# EasyEDA Pro project WIF电流表带PCB+原理图.epro

# Schematic 电流表0603板优化版
Create Date: 2024-01-17; Page Name: 电流表0603板优化版; Project Name: WIF板电流表pro分享板; Schematic Name: 电流表0603板优化版; Update Date: 2024-01-17; Company: 嘉立创EDA; Page Size: A4; Version: V1.0
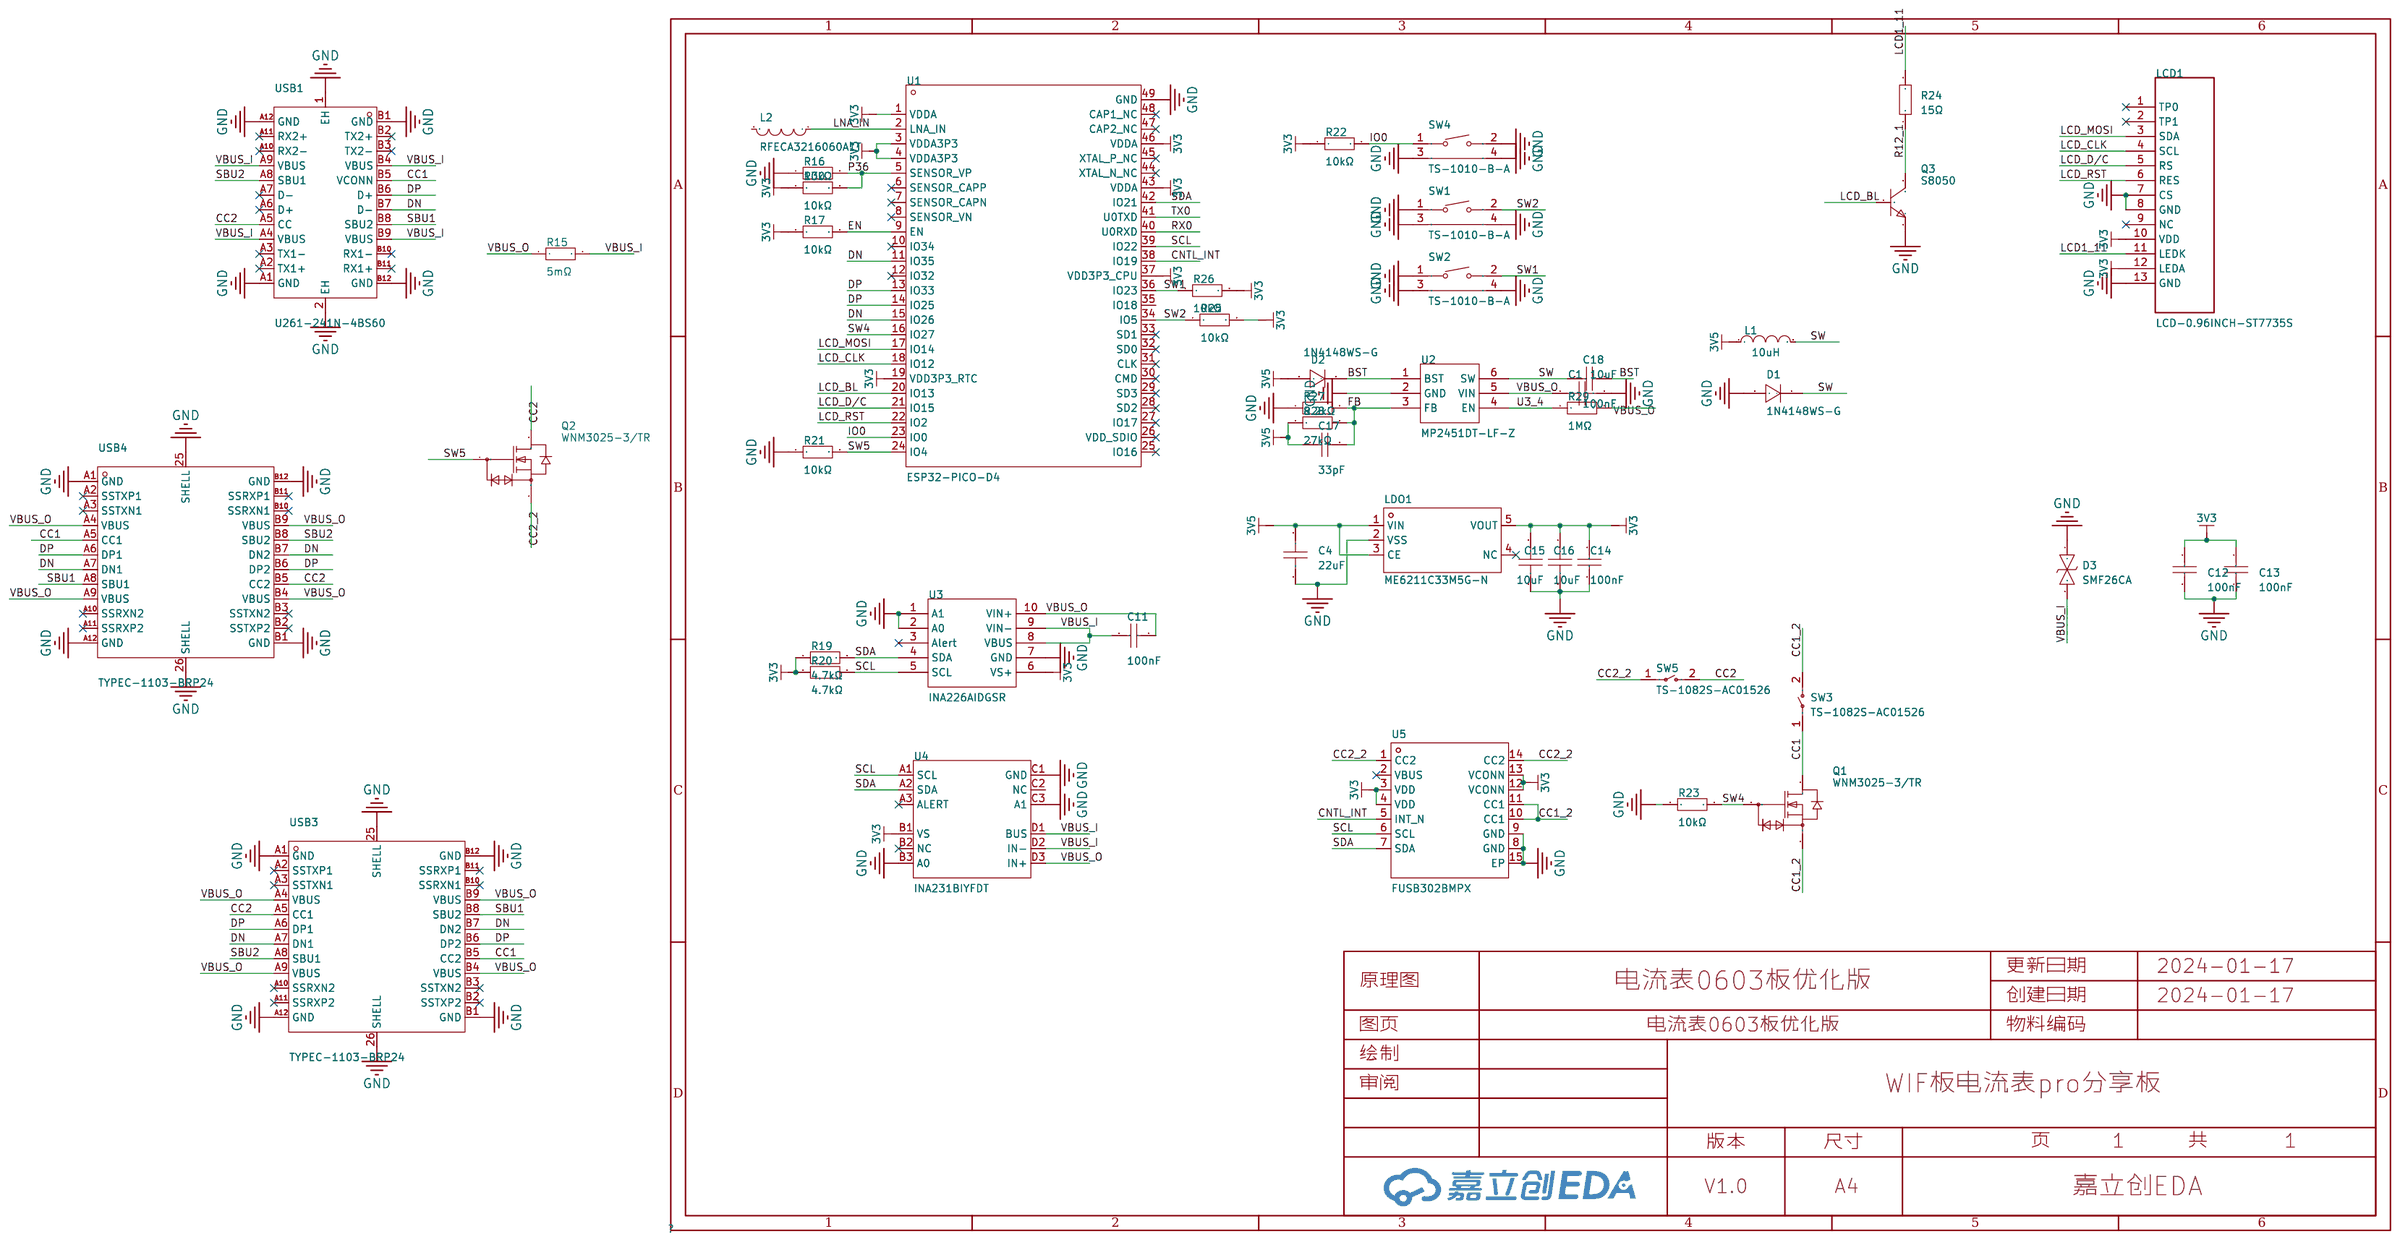
[diagram p0: schematic sheet]

## Parts
C1  10uF  [C0603]
C4  22uF  [C0603]
C11  100nF  [C0603]
C12  100nF  [C0603]
C13  100nF  [C0603]
C14  100nF  [C0603]
C15  10uF  [C0603]
C16  10uF  [C0603]
C17  33pF  [C0603]
C18  100nF  [C0603]
D1  1N4148WS-G  [SOD-323_L1.7-W1.3-LS2.7-RD]
D2  1N4148WS-G  [SOD-323_L1.7-W1.3-LS2.7-RD]
D3  SMF26CA  [SOD-123_L2.8-W1.8-LS3.7-BI]
L1  10uH  [IND-SMD_L4.4-W4.0_PHC0420]
L2  RFECA3216060A1T  [ANT-SMD_L3.1-W1.6]
LCD1  LCD-0.96INCH-ST7735S  [LCD-0.96INCH-IPS-TFT-16080-ST7735S]
LDO1  ME6211C33M5G-N  [SOT-23-5_L3.0-W1.7-P0.95-LS2.8-BL]
Q1  WNM3025-3/TR  [X1-DFN1006-3_L1.0-W0.6-P0.35-BR]
Q2  WNM3025-3/TR  [X1-DFN1006-3_L1.0-W0.6-P0.35-BR]
Q3  S8050  [SOT-23-3_L2.9-W1.3-P1.90-LS2.4-BR]
R15  5mΩ  [R2512]
R16  10kΩ  [R0603]
R17  10kΩ  [R0603]
R19  4.7kΩ  [R0603]
R20  4.7kΩ  [R0603]
R21  10kΩ  [R0603]
R22  10kΩ  [R0603]
R23  10kΩ  [R0603]
R24  15Ω  [R0603]
R25  10kΩ  [R0603]
R26  10kΩ  [R0603]
R27  8.2kΩ  [R0603]
R28  27kΩ  [R0603]
R29  1MΩ  [R0603]
R30  10kΩ  [R0402]
SW1  TS-1010-B-A  [KEY-SMD_TX-1010-X-X]
SW2  TS-1010-B-A  [KEY-SMD_TX-1010-X-X]
SW3  TS-1082S-AC01526  [SW-SMD_L3.9-W3.6-LS4.8-EH]
SW4  TS-1010-B-A  [KEY-SMD_TX-1010-X-X]
SW5  TS-1082S-AC01526  [SW-SMD_L3.9-W3.6-LS4.8-EH]
U1  ESP32-PICO-D4  [LGA-48_L7.0-W7.0-P0.50-BL-EP5.4]
U2  MP2451DT-LF-Z  [SOT-23-6_L2.9-W1.6-P0.95-LS2.8-BR]
U3  INA226AIDGSR  [MSOP-10_L3.0-W3.0-P0.50-LS5.0-BL]
U4  INA231BIYFDT  [DSBGA-12_L1.7-W1.4-R3-C4-P0.40-BL]
U5  FUSB302BMPX  [MLP-14_L2.5-W2.5-P0.50-BL-EP]
USB1  U261-241N-4BS60  [USB-TYPE-C-SMD_U261-241N-4BS60]
USB3  TYPEC-1103-BRP24  [USB-C-SMD_TYPEC-1103-BRP24]
USB4  TYPEC-1103-BRP24  [USB-C-SMD_TYPEC-1103-BRP24]

## Library data of the parts
C1 = CL10A106MA8NRNC: 容值:10uF;精度:±20%;额定电压:25V;材质(温度系数):X5R;; LCSC Part Name: 10uF ±20% 25V; Supplier Part: C96446; Manufacturer: SAMSUNG(三星); Supplier Footprint: 0603; JLCPCB Part Class: 基础库; Datasheet: https://atta.szlcsc.com/upload/public/pdf/source/20160218/1457707763339.pdf; Supplier: LCSC; Tolerance: ±20%; Voltage Rated: 25V; Temperature Coefficient: X5R
C4 = CL10A226MQ8NRNC: 容值:22uF;精度:±20%;额定电压:6.3V;材质(温度系数):X5R;; LCSC Part Name: 22uF ±20% 6.3V; Supplier Part: C59461; Manufacturer: SAMSUNG(三星); Supplier Footprint: 0603; Datasheet: https://atta.szlcsc.com/upload/public/pdf/source/20160218/1457707763339.pdf; Supplier: LCSC; Tolerance: ±20%; Voltage Rated: 6.3V; Temperature Coefficient: X5R
C11-C14 C18 = 0603B104K500NT: 容值:100nF;精度:±10%;额定电压:50V;材质(温度系数):X7R;; LCSC Part Name: 100nF ±10% 50V; Supplier Part: C30926; Manufacturer: FH(风华); Supplier Footprint: 0603; Datasheet: https://atta.szlcsc.com/upload/public/pdf/source/20200305/C486355_26A10D38EF8C2A5C37091D0039909270.pdf; Supplier: LCSC; Tolerance: ±10%; Voltage Rated: 50V; Temperature Coefficient: X7R
C15 C16 = CL10A106KP8NNNC: 容值:10uF;精度:±10%;额定电压:10V;材质(温度系数):X5R;; LCSC Part Name: 10uF ±10% 10V; Supplier Part: C19702; Manufacturer: SAMSUNG(三星); Supplier Footprint: 0603; Datasheet: https://atta.szlcsc.com/upload/public/pdf/source/20160218/1457707763339.pdf; Supplier: LCSC; Tolerance: ±10%; Voltage Rated: 10V; Temperature Coefficient: X5R
C17 = CL10C330JB8NNNC: 容值:33pF;精度:±5%;额定电压:50V;材质(温度系数):C0G;; LCSC Part Name: 33pF ±5% 50V; Supplier Part: C1663; Manufacturer: SAMSUNG(三星); Supplier Footprint: 0603; Datasheet: https://atta.szlcsc.com/upload/public/pdf/source/20160218/1457707763339.pdf; Supplier: LCSC; Tolerance: ±5%; Voltage Rated: 50V; Temperature Coefficient: C0G
D1 D2 = 1N4148WS-G: 二极管配置:独立式;正向压降(Vf):1.25V@150mA;直流反向耐压(Vr):100V;平均整流电流(Io):150mA;功率:200mW;反向恢复时间(trr):4ns;; LCSC Part Name: 电压:100V 电流:150mA; Supplier Part: C164914; Manufacturer: CJ(江苏长电/长晶); Supplier Footprint: SOD-323; Datasheet: https://atta.szlcsc.com/upload/public/pdf/source/20171228/C164914_15144413284821213917.pdf; Supplier: LCSC; Diode Configuration: 独立式; Forward Voltage (Vf@If): 1.25V@150mA; Reverse Voltage (Vr): 100V; Average Rectified Current (Io): 150mA; Power Dissipation: 200mW; Reverse Leakage Current: 1uA@75V; Reverse Recovery Time (trr): 4ns
D3 = SMF26CA_C435495: 极性:双向;反向截止电压(Vrwm):26V;击穿电压:28.9V;峰值脉冲电流(Ipp)@10/1000μs:4.8A;最大钳位电压:42.1V;; LCSC Part Name: 双向 Vrwm:26V; Supplier Part: C435495; Manufacturer: AnBon(安邦); Supplier Footprint: SOD-123; Datasheet: https://atta.szlcsc.com/upload/public/pdf/source/20191009/C435495_EFB4EDACE97A58C3299DB23ED1145BFC.pdf; Supplier: LCSC; Polarity: 双向; Reverse Stand-Off Voltage (Vrwm): 26V; Breakdown Voltage: 28.9V; Peak Pulse Current (Ipp)@10/1000μs: 4.8A; Maximum Clamping Voltage: 42.1V
L1 = PHC0420-100M-T: 电感值:10uH;精度:±20%;额定电流:1.6A;; LCSC Part Name: 10uH ±20% 1.6A 282mΩ; Supplier Part: C251694; Manufacturer: EMTEK(兆欣); Supplier Footprint: SMD; Datasheet: https://atta.szlcsc.com/upload/public/pdf/source/20180810/C251694_68A827D6135E57B1C0B36A701F1CEEFF.pdf; Supplier: LCSC; Tolerance: ±20%; Rated Current: 1.6A; DC Resistance (DCR): 282mΩ
L2 = RFECA3216060A1T: 2.4 GHz 陶瓷天线; Supplier Part: C127620; Manufacturer: Walsin(华新科); Supplier Footprint: 贴片; Datasheet: https://atta.szlcsc.com/upload/public/pdf/source/20180326/C127620_3C564CCA307EE04222EAFCE04B7FD99A.pdf; Supplier: LCSC
LCD1 = LCD-0.96INCH-ST7735S-1
LDO1 = ME6211C33M5G-N: 输出类型:固定;输出极性:正;最大输入电压:6V;输出电压:3.3V;输出电流:500mA;电源纹波抑制比(PSRR):70dB;; Supplier Part: C82942; Manufacturer: MICRONE(南京微盟); Supplier Footprint: SOT-23-5; Datasheet: https://atta.szlcsc.com/upload/public/pdf/source/20170918/C82942_1505727073070976520.pdf; Supplier: LCSC; Output Type: 固定; Output Polarity: 正; Number of Outputs: 1; Maximum Input Voltage: 6V; Output Voltage: 3.3V; Dropout Voltage: 260mV@(200mA); Output Current: 500mA; Power Supply Rejection Ratio (PSRR): 70dB
Q1 Q2 = WNM3025-3/TR: 类型:N沟道;阈值电压(Vgs(th)@Id):1V@250uA;漏源电压(Vdss):50V;连续漏极电流(Id):210mA;功率(Pd):270mW;导通电阻(RDS(on)@Vgs,Id):1.2Ω@10V,450mA;; LCSC Part Name: N沟道 耐压:50V 电流:210mA; Supplier Part: C240200; Manufacturer: WILLSEMI(韦尔); Supplier Footprint: X1-DFN1006-3; Datasheet: https://atta.szlcsc.com/upload/public/pdf/source/20200325/C240200_AABA9DA76AE1A371FB49AC1D4C9095FF.pdf; Supplier: LCSC; Type: N沟道; Gate Threshold Voltage (Vgs(th)@Id): 1V@250uA; Drain Source Voltage (Vdss): 50V; Continuous Drain Current (Id): 210mA; Power Dissipation (Pd): 270mW; Drain Source On Resistance (RDS(on)@Vgs,Id): 1.2Ω@10V,450mA; Total Gate Charge (Qg@Vgs): 1.6nC@10V; Input Capacitance (Ciss@Vds): 23pF@15V; Reverse Transfer Capacitance (Crss@Vds): 5pF@15V; Operating Temperature: -55℃~+150℃@(Tj)
Q3 = S8050_C916390: 晶体管类型:-;集电极电流(Ic):500mA;集射极击穿电压(Vceo):25V;功率(Pd):300mW;; LCSC Part Name: 电流:500mA 耐压:25V; Supplier Part: C916390; Manufacturer: JSMSEMI(杰盛微); Supplier Footprint: SOT-23; Datasheet: https://atta.szlcsc.com/upload/public/pdf/source/20230807/2EB23ED2C820E6EDA7BD0AA9F6E62B00.pdf; Supplier: LCSC; Collector Current (Ic): 500mA; Collector-Emitter Breakdown Voltage (Vceo): 25V; Power Dissipation (Pd): 300mW; Transition Frequency (fT): 150MHz; Collector Cut-Off Current (Icbo): 100nA; Collector-Emitter Saturation Voltage (VCE(sat)@Ic,Ib): 600mV@500mA,50mA
R15 = LR2512-23R005F4: 阻值:5mΩ;精度:±1%;功率:3W;温度系数:±25ppm/℃;; LCSC Part Name: 5mΩ ±1% 3W; Supplier Part: C154688; Manufacturer: RALEC(旺诠); Supplier Footprint: 2512; Datasheet: https://atta.szlcsc.com/upload/public/pdf/source/20191219/C323806_6AA59EC2012F49CDB3E3BC364EF84C00.pdf; Supplier: LCSC; Tolerance: ±1%; Power(Watts): 3W; Temperature Coefficient: ±25ppm/℃
R16 R17 R21-R23 R25 R26 = 0603WAF1002T5E: 阻值:10kΩ;精度:±1%;功率:100mW;温度系数:±100ppm/℃;电阻类型:厚膜电阻;; LCSC Part Name: 10kΩ ±1% 100mW 厚膜电阻; Supplier Part: C25804; Manufacturer: UNI-ROYAL(厚声); Supplier Footprint: 0603; Datasheet: https://atta.szlcsc.com/upload/public/pdf/source/20200306/C422600_1E6D84923E4A46A82E41ADD87F860B5C.pdf; Supplier: LCSC; Tolerance: ±1%; Power(Watts): 100mW; Overload Voltage (Max): 75V; Temperature Coefficient: ±100ppm/℃; Type: 厚膜电阻; Operating Temperature Range: -55℃~+155℃
R19 R20 = 0603WAF4701T5E: 阻值:4.7kΩ;精度:±1%;功率:100mW;温度系数:±100ppm/℃;电阻类型:厚膜电阻;; LCSC Part Name: 4.7kΩ ±1% 100mW 厚膜电阻; Supplier Part: C23162; Manufacturer: UNI-ROYAL(厚声); Supplier Footprint: 0603; Datasheet: https://atta.szlcsc.com/upload/public/pdf/source/20200306/C422600_1E6D84923E4A46A82E41ADD87F860B5C.pdf; Supplier: LCSC; Tolerance: ±1%; Power(Watts): 100mW; Overload Voltage (Max): 75V; Temperature Coefficient: ±100ppm/℃; Type: 厚膜电阻; Operating Temperature Range: -55℃~+155℃
R24 = 0603WAF150JT5E: 阻值:15Ω;精度:±1%;功率:100mW;温度系数:±100ppm/℃;电阻类型:厚膜电阻;; LCSC Part Name: 15Ω ±1% 100mW 厚膜电阻; Supplier Part: C22810; Manufacturer: UNI-ROYAL(厚声); Supplier Footprint: 0603; Datasheet: https://atta.szlcsc.com/upload/public/pdf/source/20200306/C422600_1E6D84923E4A46A82E41ADD87F860B5C.pdf; Supplier: LCSC; Tolerance: ±1%; Power(Watts): 100mW; Overload Voltage (Max): 75V; Temperature Coefficient: ±100ppm/℃; Type: 厚膜电阻; Operating Temperature Range: -55℃~+155℃
R27 = 0603WAF8201T5E: 阻值:8.2kΩ;精度:±1%;功率:100mW;温度系数:±100ppm/℃;电阻类型:厚膜电阻;; LCSC Part Name: 8.2kΩ ±1% 100mW 厚膜电阻; Supplier Part: C25981; Manufacturer: UNI-ROYAL(厚声); Supplier Footprint: 0603; Datasheet: https://atta.szlcsc.com/upload/public/pdf/source/20200306/C422600_1E6D84923E4A46A82E41ADD87F860B5C.pdf; Supplier: LCSC; Tolerance: ±1%; Power(Watts): 100mW; Overload Voltage (Max): 75V; Temperature Coefficient: ±100ppm/℃; Type: 厚膜电阻; Operating Temperature Range: -55℃~+155℃
R28 = 0603WAF2702T5E: 阻值:27kΩ;精度:±1%;功率:100mW;温度系数:±100ppm/℃;电阻类型:厚膜电阻;; LCSC Part Name: 27kΩ ±1% 100mW 厚膜电阻; Supplier Part: C22967; Manufacturer: UNI-ROYAL(厚声); Supplier Footprint: 0603; Datasheet: https://atta.szlcsc.com/upload/public/pdf/source/20200306/C422600_1E6D84923E4A46A82E41ADD87F860B5C.pdf; Supplier: LCSC; Tolerance: ±1%; Power(Watts): 100mW; Overload Voltage (Max): 75V; Temperature Coefficient: ±100ppm/℃; Type: 厚膜电阻; Operating Temperature Range: -55℃~+155℃
R29 = 0603WAF1004T5E: 阻值:1MΩ;精度:±1%;功率:100mW;温度系数:±100ppm/℃;电阻类型:厚膜电阻;; LCSC Part Name: 1MΩ ±1% 100mW 厚膜电阻; Supplier Part: C22935; Manufacturer: UNI-ROYAL(厚声); Supplier Footprint: 0603; JLCPCB Part Class: 基础库; Datasheet: https://atta.szlcsc.com/upload/public/pdf/source/20200306/C422600_1E6D84923E4A46A82E41ADD87F860B5C.pdf; Supplier: LCSC; Tolerance: ±1%; Power(Watts): 100mW; Overload Voltage (Max): 75V; Temperature Coefficient: ±100ppm/℃; Type: 厚膜电阻; Operating Temperature Range: -55℃~+155℃
R30 = RC0402FR-0710KL: 电阻类型:厚膜电阻;阻值:10kΩ;精度:±1%;功率:62.5mW;; LCSC Part Name: 10kΩ ±1% 62.5mW; Supplier Part: C60490; Manufacturer: YAGEO(国巨); Supplier Footprint: 0402; Datasheet: https://atta.szlcsc.com/upload/public/pdf/source/20170606/1496716515432.pdf; Supplier: LCSC; Type: 厚膜电阻; Tolerance: ±1%; Power(Watts): 62.5mW; Temperature Coefficient: ±100ppm/℃; Overload Voltage (Max): 50V; Operating Temperature Range: -55℃~+155℃
SW1 SW2 SW4 = TS-1010-B-A: 触点电流:50mA;额定电压(DC):12V;绝缘电阻:-;电路结构:单刀单掷;安装方式:卧贴;带灯:无;作用力:160gf;机械寿命:10万次;带支架:否;; LCSC Part Name: 4.7*1.9*3.5mm 卧贴 轻触开关; Supplier Part: C318941; Manufacturer: XKB Connectivity(中国星坤); Supplier Footprint: SMD; Datasheet: https://atta.szlcsc.com/upload/public/pdf/source/20200227/C318941_A5A5DBAB1B24E3EFC34CEC5510EE9B45.pdf; Supplier: LCSC; Contact Current: 50mA; Voltage Rating (DC): 12V; Circuit: 单刀单掷; Mounting Style: 卧贴; Actuator Style: 矩形按钮; Actuator/Cap Color: 黑色; With Lamp: 无; Operating Force: 160gf; Mechanical Life: 10万次; Operating Temperature: -30℃~+85℃; Switch Length: 4.7mm; Switch Width: 1.9mm; Switch Height: 3.5mm; Strike Gundam: 否
SW3 SW5 = TS-1082S-AC01526: 电路结构:单刀单掷;触点电流:50mA;额定电压(DC):12V;安装方式:卧贴;绝缘电阻:100MΩ;作用力:260gf@±50gf;机械寿命:10万次;; LCSC Part Name: 3.9*2.9*1.5mm 卧贴 轻触开关; Supplier Part: C720494; Manufacturer: XUNPU(讯普); Supplier Footprint: SMD; JLCPCB Part Class: 扩展库; Datasheet: https://atta.szlcsc.com/upload/public/pdf/source/20200810/C720494_98DBDAE35F8150C1537AC0512F50420B.pdf; Supplier: LCSC; Circuit: 单刀单掷; Actuator Style: 矩形按钮; Switch Length: 3.9mm; Switch Width: 2.9mm; Switch Height: 1.5mm; Contact Current: 50mA; Voltage Rating (DC): 12V; Mounting Style: 卧贴; Insulation Resistance: 100MΩ; Actuator/Cap Color: 黑色; Operating Force: 260gf@±50gf; Pin Style: SMD接片; Mechanical Life: 10万次; Operating Temperature: -30℃~+80℃
U1 = ESP32-PICO-D4: 频率范围:2.4GHz~2.5GHz;接口:ADC, SDIO, SPI, PWM, UART, I2C, I2S, GPIO;应用领域:蓝牙,WiFi;数据速率:-;灵敏度:-;典型应用频率:-;; LCSC Part Name: 集成2.4GHz WIFI和蓝牙的模组; Supplier Part: C193707; Manufacturer: ESPRESSIF(乐鑫); Supplier Footprint: QFN-48-EP(7x7); JLCPCB Part Class: 扩展库; Datasheet: https://atta.szlcsc.com/upload/public/pdf/source/20180531/C193707_20E6BADDB6EC95F0C0D505BA515D2866.pdf; Supplier: LCSC; Frequency Range: 2.4GHz~2.5GHz; Interface: ADC, SDIO, SPI, PWM, UART, I2C, I2S, GPIO; Operating Voltage: 2.7V~3.6V; Applications: 蓝牙,WiFi; Operating Temperature: -40℃~+85℃
U2 = MP2451DT-LF-Z: 最大输入电压:-;可输出电流:-;; Supplier Part: C14123; Supplier Footprint: SOT-23-6; JLCPCB Part Class: 扩展库; Datasheet: https://atta.szlcsc.com/upload/public/pdf/source/20200722/C14123_A1B4D2FF88F8729F8C1A187DEC359FB0.pdf; Supplier: LCSC
U3 = INA226AIDGSR: INA226 支持报警功能的 36V、双向、超高精度、低侧/高侧、I2C 输出电流/功率监控器; Supplier Part: C49851; Manufacturer: TI(德州仪器); Supplier Footprint: MSOP-10; Datasheet: https://www.ti.com/cn/lit/gpn/ina226; Supplier: LCSC; Supply Voltage: 0V~36V; Operating Temperature: -40℃~+125℃
U4 = INA231BIYFDT: 采用 WCSP 封装的 28V、16 位、I2C 输出电流/电压/功率监控器 12-DSBGA -40 to 125; Supplier Part: C2155737; Manufacturer: TI(德州仪器); Supplier Footprint: DSBGA-12(1.65x1.39); Datasheet: https://atta.szlcsc.com/upload/public/pdf/source/20230221/396211147C54374608C188F987A33818.pdf; Supplier: LCSC
U5 = FUSB302BMPX: 应用功能:-;接口协议:-;; Supplier Part: C132291; Manufacturer: onsemi(安森美); Supplier Footprint: MLP-14; Datasheet: https://atta.szlcsc.com/upload/public/pdf/source/20170925/C132291_1506321679858990471.pdf; Supplier: LCSC
USB1 = U261-241N-4BS60: 连接器类型:Type-C;标准:USB 3.1;公母:公;触点数量:24P;端口数量:1;安装方式:夹板;额定电流 - 电源:5A;触头材质:高导铜;触头镀层:金;工作温度范围:-40℃~+85℃;焊接温度(最大值):260℃;; LCSC Part Name: Type-C 公 夹板 高导铜; Supplier Part: C319150; Manufacturer: XKB Connectivity(中国星坤); Supplier Footprint: SMD; Datasheet: https://atta.szlcsc.com/upload/public/pdf/source/20200227/C319150_AD2CD3943CA114D7AAA081193314EFA4.pdf; Supplier: LCSC; Connector Type: Type-C; Standard: USB 3.1; Gender: 公; Number of Contacts: 24P; Number of Ports: 1; Mounting Style: 夹板; Current Rating - Power (Max): 5A; Contact Material: 高导铜; Contact Plating: 金; Operating Temperature Range: -40℃~+85℃; Welding Temperature (Max): 260℃
USB3 USB4 = TYPEC-1103-BRP24: 连接器类型:Type-C;标准:USB 3.1;公母:母;触点数量:24P;端口数量:1;安装方式:夹板;额定电流 - 电源:5A;工作温度范围:-30℃~+85℃;焊接温度(最大值):260℃;; LCSC Part Name: Type-C 母 夹板; Supplier Part: C2856665; Manufacturer: XUNPU(讯普); Supplier Footprint: SMD; JLCPCB Part Class: 扩展库; Datasheet: https://atta.szlcsc.com/upload/public/pdf/source/20220916/9C8CB477EC6775E046E4DED126C7C51B.pdf; Supplier: LCSC; Connector Type: Type-C; Standard: USB 3.1; Gender: 母; Number of Contacts: 24P; Number of Ports: 1; Mounting Style: 夹板; Current Rating - Power (Max): 5A; Operating Temperature Range: -30℃~+85℃; Welding Temperature (Max): 260℃

## Nets
3V3: C12.2 C13.2 C14.2 C15.2 C16.2 LCD1.10(VDD) LCD1.12(LEDA) LDO1.5(VOUT) R17.1 R19.1 R20.1 R22.1 R25.2 R26.2 R30.1 U1.1(VDDA) U1.3(VDDA3P3) U1.4(VDDA3P3) U1.19(VDD3P3_RTC) U1.37(VDD3P3_CPU) U1.43(VDDA) U1.46(VDDA) U3.6(VS+) U4.B1(VS) U5.3(VDD) U5.4(VDD) U5.12(VCONN) U5.13(VCONN)
3V5: C4.2 C17.1 D2.2(+) L1.1 LDO1.1(VIN) LDO1.3(CE) R28.1
GND: C1.2 C4.1 C12.1 C13.1 C14.1 C15.1 C16.1 D1.2(+) D3.1 LCD1.7(CS) LCD1.8(GND) LCD1.13(GND) LDO1.2(VSS) Q3.2(E) R16.1 R21.1 R23.1 R27.1 SW1.1 SW1.3 SW1.4 SW2.1 SW2.3 SW2.4 SW4.2 SW4.3 SW4.4 U1.49(GND) U2.2(GND) U3.1(A1) U3.2(A0) U3.7(GND) U4.B3(A0) U4.C1(GND) U4.C3(A1) U5.8(GND) U5.9(GND) U5.15(EP) USB1.1(EH) USB1.2(EH) USB1.A1(GND) USB1.A12(GND) USB1.B1(GND) USB1.B12(GND) USB3.25(SHELL) USB3.26(SHELL) USB3.A1(GND) USB3.A12(GND) USB3.B1(GND) USB3.B12(GND) USB4.25(SHELL) USB4.26(SHELL) USB4.A1(GND) USB4.A12(GND) USB4.B1(GND) USB4.B12(GND)
VBUS_I: C11.1 D3.2 R15.2 U3.8(VBUS) U3.9(VIN-) U4.D1(BUS) U4.D2(IN-) USB1.A4(VBUS) USB1.A9(VBUS) USB1.B4(VBUS) USB1.B9(VBUS)
VBUS_O: C1.1 C11.2 R15.1 R29.2 U2.5(VIN) U3.10(VIN+) U4.D3(IN+) USB3.A4(VBUS) USB3.A9(VBUS) USB3.B4(VBUS) USB3.B9(VBUS) USB4.A4(VBUS) USB4.A9(VBUS) USB4.B4(VBUS) USB4.B9(VBUS)
BST: C18.2 D2.1(-) U2.1(BST)
CC1: Q1.3(D) SW3.1 USB1.B5(VCONN) USB3.B5(CC2) USB4.A5(CC1)
CC1_2: Q1.2(S) SW3.2 U5.10(CC1) U5.11(CC1)
CC2: Q2.3(D) SW5.2 USB1.A5(CC) USB3.A5(CC1) USB4.B5(CC2)
CC2_2: Q2.2(S) SW5.1 U5.1(CC2) U5.14(CC2)
CNTL_INT: U1.38(IO19) U5.5(INT_N)
DN: U1.11(IO35) U1.15(IO26) USB1.B7(D-) USB3.A7(DN1) USB3.B7(DN2) USB4.A7(DN1) USB4.B7(DN2)
DP: U1.13(IO33) U1.14(IO25) USB1.B6(D+) USB3.A6(DP1) USB3.B6(DP2) USB4.A6(DP1) USB4.B6(DP2)
EN: R17.2 U1.9(EN)
FB: C17.2 R27.2 R28.2 U2.3(FB)
IO0: R22.2 SW4.1 U1.23(IO0)
LCD1_11: LCD1.11(LEDK) R24.2
LCD_BL: Q3.1(B) U1.20(IO13)
LCD_CLK: LCD1.4(SCL) U1.18(IO12)
LCD_D/C: LCD1.5(RS) U1.21(IO15)
LCD_MOSI: LCD1.3(SDA) U1.17(IO14)
LCD_RST: LCD1.6(RES) U1.22(IO2)
LNA_IN: L2.1 U1.2(LNA_IN)
P36: R16.2 R30.2 U1.5(SENSOR_VP)
R12_1: Q3.3(C) R24.1
RX0: U1.40(U0RXD)
SBU1: USB1.B8(SBU2) USB3.B8(SBU2) USB4.A8(SBU1)
SBU2: USB1.A8(SBU1) USB3.A8(SBU1) USB4.B8(SBU2)
SCL: R20.2 U1.39(IO22) U3.5(SCL) U4.A1(SCL) U5.6(SCL)
SDA: R19.2 U1.42(IO21) U3.4(SDA) U4.A2(SDA) U5.7(SDA)
SW: C18.1 D1.1(-) L1.2 U2.6(SW)
SW1: R26.1 SW2.2 U1.36(IO23)
SW2: R25.1 SW1.2 U1.34(IO5)
SW4: Q1.1(G) R23.2 U1.16(IO27)
SW5: Q2.1(G) R21.2 U1.24(IO4)
TX0: U1.41(U0TXD)
U3_4: R29.1 U2.4(EN)

Not connected (* = marked no-connect by the designer): L2 2; LCD1 1(TP0)* 2(TP1)* 9(NC)*; LDO1 4(NC)*; U1 6(SENSOR_CAPP)* 7(SENSOR_CAPN)* 8(SENSOR_VN)* 10(IO34)* 12(IO32)* 25(IO16)* 26(VDD_SDIO)* 27(IO17)* 28(SD2)* 29(SD3)* 30(CMD)* 31(CLK)* 32(SD0)* 33(SD1)* 35(IO18) 44(XTAL_N_NC)* 45(XTAL_P_NC)* 47(CAP2_NC)* 48(CAP1_NC)*; U3 3(Alert)*; U4 A3(ALERT)* B2(NC)* C2(NC); U5 2(VBUS)*; USB1 A2(TX1+)* A3(TX1-)* A6(D+)* A7(D-)* A10(RX2-)* A11(RX2+)* B2(TX2+)* B3(TX2-)* B10(RX1-)* B11(RX1+)*; USB3 A2(SSTXP1)* A3(SSTXN1)* A10(SSRXN2)* A11(SSRXP2)* B2(SSTXP2)* B3(SSTXN2)* B10(SSRXN1)* B11(SSRXP1)*; USB4 A2(SSTXP1)* A3(SSTXN1)* A10(SSRXN2)* A11(SSRXP2)* B2(SSTXP2)* B3(SSTXN2)* B10(SSRXN1)* B11(SSRXP1)*

# Board 电流表0603板优化版加大_1
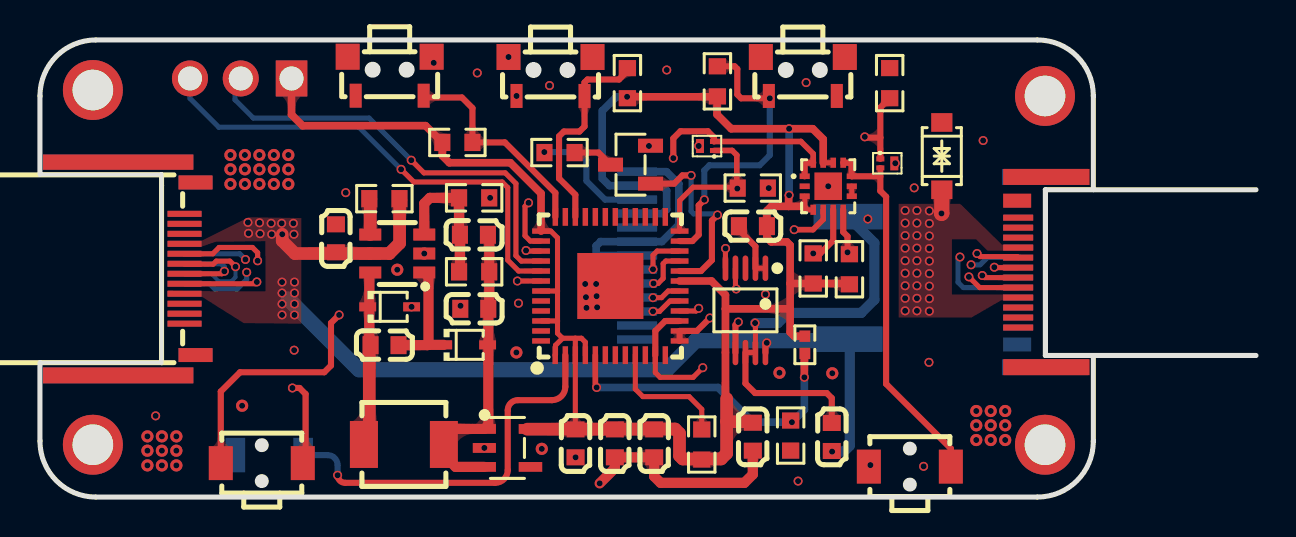
[diagram p1: board, top side]
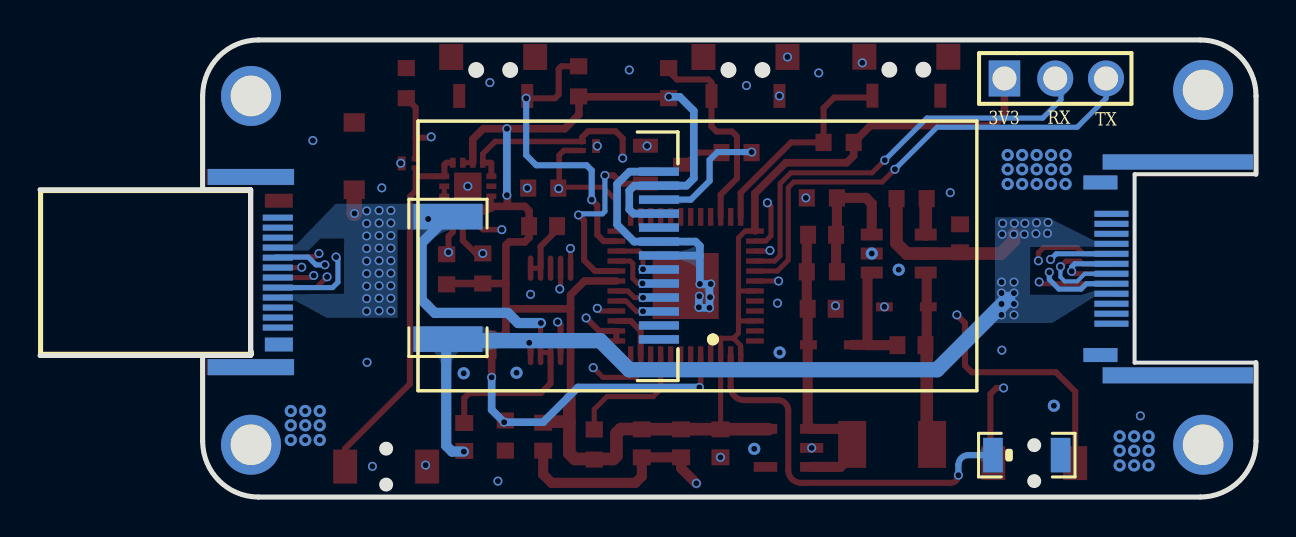
[diagram p2: board, bottom side, seen from below]

Outline 60.81 x 22.89 mm; copper layers: Top Layer, Inner1, Inner2, Bottom Layer. Coordinates in mm from the lower left corner of the outline.
Outline path: 50.28,15.39 52.68,15.39 52.68,20.09 arc(51.86,22.07) 49.89,22.89 2.79,22.89 arc(0.82,22.07) 0,20.09 0,16.16 6.07,16.16 6.07,6.73 0,6.73 0,2.79 arc(0.82,0.82) 2.79,0 49.89,0 arc(51.86,0.82) 52.68,2.79 52.68,7.09
Stack: Top Layer 0.035mm / Dielectric1 0.48mm PP er 4.5 / Inner1 0.035mm / Dielectric2 0.48mm FR4 er 4.5 / Inner2 0.035mm / Dielectric3 0.48mm PP er 4.5 / Bottom Layer 0.035mm

## Design rules (mm)
net DN: DP1
net DP: DP1
spacing Default (default): track to track 0.152, other pairs 0 to 0.152
track width Default (default): min 0.152, default 0.152, max 25.4
differential pair differentialPair (default): width min 0.127, default 0.254, max 2.54; gap min 0.152, default 0.152
via Default (default): diameter min 0.45, default 0.45, max 100.025; hole min 0.3, default 0.3, max 59.995
net GND uses gge170519
pour e345 uses gge165214
pour e348 uses gge170634
pour e445 uses gge182666
pour e1499 uses gge170519

## Placement (name value [footprint] x y rotation side)
C1  10uF  [C0603]  14.8 12.95 90 top
C4  22uF  [C0603]  21.72 9.42 0 top
C11  100nF  [C0603]  39.6 3.01 270 top
C12  100nF  [C0603]  35.65 13.56 0 top
C13  100nF  [C0603]  35.65 3.02 90 top
C14  100nF  [C0603]  28.75 2.69 90 top
C15  10uF  [C0603]  26.79 2.69 90 top
C16  10uF  [C0603]  30.72 2.69 90 top
C17  33pF  [C0603]  21.7 13.13 180 top
C18  100nF  [C0603]  17.23 7.61 0 top
D1  1N4148WS-G  [SOD-323_L1.7-W1.3-LS2.7-RD]  17.49 9.52 0 top
D2  1N4148WS-G  [SOD-323_L1.7-W1.3-LS2.7-RD]  21.29 7.62 0 top
D3  SMF26CA  [SOD-123_L2.8-W1.8-LS3.7-BI]  45.1 17.07 90 top
H2  -  [HDR-TH_3P-P2.54-V-M-1]  10.04 20.96 180 bottom
L1  10uH  [IND-SMD_L4.4-W4.0_PHC0420]  18.2 2.63 180 top
L2  RFECA3216060A1T  [ANT-SMD_L3.1-W1.6]  11.46 2.1 180 bottom
LCD1  LCD-0.96INCH-ST7735S  [LCD-0.96INCH-IPS-TFT-16080-ST7735S]  29.16 12.09 0 bottom
LCD1#2  -  [LCD-0.96INCH-IPS-TFT-16080-ST7735S]  29.16 12.09 0 bottom
LDO1  ME6211C33M5G-N  [SOT-23-5_L3.0-W1.7-P0.95-LS2.8-BL]  23.38 2.46 270 top
NOREF  -  [Pad_e2158]  2.64 2.62 0 top
NOREF#2  -  [Pad_e2157]  50.26 20.08 0 top
NOREF#3  -  [Pad_e2155]  50.26 2.62 0 top
NOREF#4  -  [Pad_e351]  3.91 6.09 90 top
NOREF#5  -  [Pad_e1502]  3.91 16.77 90 top
NOREF#6  -  [Pad_e2156]  2.64 20.38 0 top
NOREF#7  -  [Pad_e1503]  3.91 6.09 90 top
NOREF#8  -  [Pad_e350]  50.27 6.5 90 top
NOREF#9  -  [Pad_e346]  3.91 16.78 90 top
NOREF#10  -  [Pad_e1501]  50.33 6.5 90 top
NOREF#11  -  [Pad_e1500]  50.33 16.03 90 top
NOREF#12  -  [Pad_e349]  50.27 16.03 90 top
Q1  WNM3025-3/TR  [X1-DFN1006-3_L1.0-W0.6-P0.35-BR]  42.38 16.71 180 top
Q2  WNM3025-3/TR  [X1-DFN1006-3_L1.0-W0.6-P0.35-BR]  33.36 17.58 0 top
Q3  S8050  [SOT-23-3_L2.9-W1.3-P1.90-LS2.4-BR]  29.53 16.64 0 top
R15  5mΩ  [R2512]  40.41 10.97 90 bottom
R16  10kΩ  [R0603]  37.54 3.08 90 top
R17  10kΩ  [R0603]  33.1 2.63 90 top
R19  4.7kΩ  [R0603]  40.48 11.4 90 top
R20  4.7kΩ  [R0603]  38.67 11.44 90 top
R21  10kΩ  [R0603]  35.65 15.47 180 top
R22  10kΩ  [R0603]  33.88 20.81 90 top
R23  10kΩ  [R0603]  42.49 20.72 270 top
R24  15Ω  [R0603]  25.98 17.25 180 top
R25  10kΩ  [R0603]  29.38 20.72 270 top
R26  10kΩ  [R0603]  20.87 17.75 180 top
R27  8.2kΩ  [R0603]  21.71 14.98 180 top
R28  27kΩ  [R0603]  21.71 11.28 180 top
R29  1MΩ  [R0603]  17.22 14.94 0 top
R30  10kΩ  [R0402]  38.25 7.62 270 top
SW1  TS-1010-B-A  [KEY-SMD_TX-1010-X-X]  25.53 21.06 0 top
SW2  TS-1010-B-A  [KEY-SMD_TX-1010-X-X]  17.49 21.07 0 top
SW3  TS-1082S-AC01526  [SW-SMD_L3.9-W3.6-LS4.8-EH]  43.5 1.52 0 top
SW4  TS-1010-B-A  [KEY-SMD_TX-1010-X-X]  38.15 21.06 0 top
SW5  TS-1082S-AC01526  [SW-SMD_L3.9-W3.6-LS4.8-EH]  11.09 1.7 0 top
U1  ESP32-PICO-D4  [lga-48_l7.0-w7.0-p0.50-bl-ep5.4]  28.52 10.57 0 top
U2  MP2451DT-LF-Z  [SOT-23-6_L2.9-W1.6-P0.95-LS2.8-BR]  17.87 12.19 0 top
U3  INA226AIDGSR  [msop-10_l3.0-w3.0-p0.50-ls5.0-bl]  35.28 9.35 180 top
U5  FUSB302BMPX  [MLP-14_L2.5-W2.5-P0.50-BL-EP]  39.42 15.56 270 top
USB1  U261-241N-4BS60  [USB-TYPE-C-SMD_U261-241N-4BS60]  48.89 11.24 270 bottom
USB4  TYPEC-1103-BRP24  [USB-C-SMD_TYPEC-1103-BRP24]  7.5 11.43 270 top

## Footprints (pads in the part's own frame, mm; a bottom-side part is the same pattern mirrored in y, then rotated)
ANT-SMD_L3.1-W1.6
  rect 0.984x1.728 smd: 1(-1.692,0) 2(1.692,0)
C0603
  rect 0.8x0.9 smd: 1(-0.7,0) 2(0.7,0)
HDR-TH_3P-P2.54-V-M-1
  rect 1.575x1.801 hole 1.199: 1(-2.54,0)
  round 1.801 hole 1.199: 2(0,0) 3(2.54,0)
IND-SMD_L4.4-W4.0_PHC0420
  rect 1.4x2.35 smd: 1(-2,0) 2(2,0)
KEY-SMD_TX-1010-X-X
  rect 0.6x1.2 smd: 1(-1.7,-0.975) 2(1.7,-0.975)
  rect 1.2x1.3 smd: 3(-2.1,0.975) 4(2.1,0.975)
LCD-0.96INCH-IPS-TFT-16080-ST7735S
  rect 2x0.4 smd: 1(0.7,4.2) 2(0.7,3.5) 3(0.7,2.8) 4(0.7,2.1) 5(0.7,1.4) 6(0.7,0.7) 7(0.7,0) 8(0.7,-0.7) 9(0.7,-1.4) 10(0.7,-2.1) 11(0.7,-2.8) 12(0.7,-3.5) 13(0.7,-4.2)
lga-48_l7.0-w7.0-p0.50-bl-ep5.4
  rect 0.27x0.889 smd: 1(-2.756,-3.465) 2(-2.25,-3.465) 3(-1.75,-3.465) 4(-1.25,-3.465) 5(-0.75,-3.465) 6(-0.25,-3.465) 7(0.25,-3.465) 8(0.75,-3.465) 9(1.25,-3.465) 10(1.75,-3.465) 11(2.25,-3.465) 12(2.75,-3.465) 25(2.75,3.459) 26(2.25,3.459) 27(1.75,3.459) 28(1.25,3.459) 29(0.75,3.459) 30(0.25,3.459) 31(-0.25,3.459) 32(-0.75,3.459) 33(-1.25,3.459) 34(-1.75,3.459) 35(-2.25,3.459) 36(-2.75,3.459)
  rect 0.889x0.27 smd: 13(3.465,-2.75) 14(3.465,-2.25) 15(3.465,-1.75) 16(3.465,-1.25) 17(3.465,-0.75) 18(3.465,-0.25) 19(3.465,0.25) 20(3.465,0.75) 21(3.465,1.25) 22(3.465,1.75) 23(3.465,2.25) 24(3.465,2.75) 37(-3.465,2.75) 38(-3.465,2.25) 39(-3.465,1.75) 40(-3.465,1.25) 41(-3.465,0.75) 42(-3.465,0.25) 43(-3.465,-0.25) 44(-3.465,-0.75) 45(-3.465,-1.25) 46(-3.465,-1.75) 47(-3.465,-2.25) 48(-3.465,-2.75)
  rect 3.302x3.302 smd: 49(0,0)
MLP-14_L2.5-W2.5-P0.50-BL-EP
  rect 0.28x0.505 smd: 1(-0.5,-1.177) 2(0,-1.177) 3(0.5,-1.177) 8(0.5,1.177) 9(0,1.177) 10(-0.5,1.177)
  rect 0.505x0.28 smd: 4(1.177,-0.75) 5(1.177,-0.25) 6(1.177,0.25) 7(1.177,0.75) 11(-1.177,0.75) 12(-1.177,0.25) 13(-1.177,-0.25) 14(-1.177,-0.75)
  rect 1.375x1.375 smd: 15(0,0)
msop-10_l3.0-w3.0-p0.50-ls5.0-bl
  oval 0.28x1.27 smd: 1(-1,-2.11) 2(-0.5,-2.11) 3(0,-2.11) 4(0.5,-2.11) 5(1,-2.11) 6(1,2.11) 7(0.5,2.11) 8(0,2.11) 9(-0.5,2.11) 10(-1,2.11)
Pad_e346
  rect 0.762x7.519 smd far side: 1(0,0)
Pad_e349
  rect 0.8x4.318 smd far side: 1(0,0)
Pad_e350
  rect 0.8x4.318 smd far side: 1(0,0)
Pad_e351
  rect 0.8x7.519 smd far side: 1(0,0)
Pad_e1500
  rect 0.8x4.318 smd: 1(0,0)
Pad_e1501
  rect 0.8x4.318 smd: 1(0,0)
Pad_e1502
  rect 0.762x7.519 smd: 1(0,0)
Pad_e1503
  rect 0.8x7.519 smd: 1(0,0)
Pad_e2155
  round 3 hole 2.032: 2(0,0)
Pad_e2156
  round 3 hole 2.032: 2(0,0)
Pad_e2157
  round 3 hole 2.032: 2(0,0)
Pad_e2158
  round 3 hole 2.032: 2(0,0)
R0402
  rect 0.566x0.54 smd: 1(-0.433,0) 2(0.433,0)
R0603
  rect 0.806x0.864 smd: 1(-0.753,0) 2(0.753,0)
R2512
  rect 1.282x3.456 smd: 1(-3.067,0) 2(3.067,0)
SOD-123_L2.8-W1.8-LS3.7-BI
  rect 0.93x1.06 smd: 1(1.685,0) 2(-1.685,0)
SOD-323_L1.7-W1.3-LS2.7-RD
  rect 0.845x0.455 smd: 1(-1.097,0) 2(1.097,0)
SOT-23-3_L2.9-W1.3-P1.90-LS2.4-BR
  rect 1.25x0.7 smd: 1(1,-0.95) 2(1,0.95) 3(-1,0)
SOT-23-5_L3.0-W1.7-P0.95-LS2.8-BL
  rect 0.49x1.157 smd: 1(-0.95,-1.153) 2(0,-1.153) 3(0.95,-1.153)
  rect 0.49x1.175 smd: 4(0.95,1.153) 5(-0.95,1.153)
SOT-23-6_L2.9-W1.6-P0.95-LS2.8-BR
  rect 1.1x0.6 smd: 1(1.35,-0.95) 2(1.35,0) 3(1.35,0.95) 4(-1.35,0.95) 5(-1.35,0) 6(-1.35,-0.95)
SW-SMD_L3.9-W3.6-LS4.8-EH
  rect 1.2x1.7 smd: 1(-2.05,0) 2(2.05,0)
USB-C-SMD_TYPEC-1103-BRP24
  rect 0.7x1.7 smd: 25(-4.32,0.275) 25(4.32,0.275)
  rect 0.7x1.7 smd far side: 26(-4.32,0.275) 26(4.32,0.275)
  rect 0.3x1.7 smd: A1(-2.75,-0.275) A2(-2.25,-0.275) A3(-1.75,-0.275) A4(-1.25,-0.275) A5(-0.75,-0.275) A6(-0.25,-0.275) A7(0.25,-0.275) A8(0.75,-0.275) A9(1.25,-0.275) A10(1.75,-0.275) A11(2.25,-0.275) A12(2.75,-0.275)
  rect 0.3x1.7 smd far side: B1(2.75,-0.275) B2(2.25,-0.275) B3(1.75,-0.275) B4(1.25,-0.275) B5(0.75,-0.275) B6(0.25,-0.275) B7(-0.25,-0.275) B8(-0.75,-0.275) B9(-1.25,-0.275) B10(-1.75,-0.275) B11(-2.25,-0.275) B12(-2.75,-0.275)
USB-TYPE-C-SMD_U261-241N-4BS60
  rect 0.7x1.4 smd far side: 1(-3.6,0.025)
  rect 0.7x1.4 smd: 2(3.6,0.025)
  rect 0.3x1.5 smd: A1(2.75,-0.025) A2(2.25,-0.025) A3(1.75,-0.025) A4(1.25,-0.025) A5(0.75,-0.025) A6(0.25,-0.025) A7(-0.25,-0.025) A8(-0.75,-0.025) A9(-1.25,-0.025) A10(-1.75,-0.025) A11(-2.25,-0.025) A12(-2.75,-0.025)
  rect 0.3x1.5 smd far side: B1(-2.75,-0.025) B2(-2.25,-0.025) B3(-1.75,-0.025) B4(-1.25,-0.025) B5(-0.75,-0.025) B6(-0.25,-0.025) B7(0.25,-0.025) B8(0.75,-0.025) B9(1.25,-0.025) B10(1.75,-0.025) B11(2.25,-0.025) B12(2.75,-0.025)
X1-DFN1006-3_L1.0-W0.6-P0.35-BR
  rect 0.4x0.25 smd: 1(0.35,-0.225) 2(0.35,0.225)
  rect 0.4x0.7 smd: 3(-0.35,0)

## Nets
3V3: C12.2 C13.2 C14.2 C15.2 C16.2 H2.1 LCD1.10 LCD1.12 LCD1#2.10 LCD1#2.12 LDO1.5 R17.1 R19.1 R20.1 R22.1 R25.2 R26.2 R30.1 U1.1 U1.3 U1.4 U1.19 U1.37 U1.43 U1.46 U3.6 U5.3 U5.4 U5.12 U5.13
3V5: C4.2 C17.1 D2.2 L1.1 LDO1.1 LDO1.3 R28.1
GND: C1.2 C4.1 C12.1 C13.1 C14.1 C15.1 C16.1 D1.2 D3.1 LCD1.7 LCD1.8 LCD1.13 LCD1#2.7 LCD1#2.8 LCD1#2.13 LDO1.2 NOREF.2 NOREF#2.2 NOREF#3.2 NOREF#4.1 NOREF#5.1 NOREF#6.2 NOREF#7.1 NOREF#8.1 NOREF#9.1 NOREF#10.1 NOREF#11.1 NOREF#12.1 Q3.2 R16.1 R21.1 R23.1 R27.1 SW1.1 SW1.3 SW1.4 SW2.1 SW2.3 SW2.4 SW4.2 SW4.3 SW4.4 U1.49 U2.2 U3.1 U3.2 U3.7 U5.8 U5.9 U5.15 USB1.1 USB1.2 USB1.A1 USB1.A12 USB1.B1 USB1.B12 USB4.25 USB4.26 USB4.A1 USB4.A12 USB4.B1 USB4.B12
VBUS_I: C11.1 D3.2 R15.2 U3.8 U3.9 USB1.A4 USB1.A9 USB1.B4 USB1.B9
VBUS_O: C1.1 C11.2 R15.1 R29.2 U2.5 U3.10 USB4.A4 USB4.A9 USB4.B4 USB4.B9
BST: C18.2 D2.1 U2.1
CC1: Q1.3 SW3.1 USB1.B5 USB4.A5
CC1_2: Q1.2 SW3.2 U5.10 U5.11
CC2: Q2.3 SW5.2 USB1.A5 USB4.B5
CC2_2: Q2.2 SW5.1 U5.1 U5.14
CNTL_INT: U1.38 U5.5
DN: U1.11 U1.15 USB1.B7 USB4.A7 USB4.B7
DP: U1.13 U1.14 USB1.B6 USB4.A6 USB4.B6
EN: R17.2 U1.9
FB: C17.2 R27.2 R28.2 U2.3
IO0: R22.2 SW4.1 U1.23
LCD1_11: LCD1.11 LCD1#2.11 R24.2
LCD_BL: Q3.1 U1.20
LCD_CLK: LCD1.4 LCD1#2.4 U1.18
LCD_D/C: LCD1.5 LCD1#2.5 U1.21
LCD_MOSI: LCD1.3 LCD1#2.3 U1.17
LCD_RST: LCD1.6 LCD1#2.6 U1.22
LNA_IN: L2.1 U1.2
P36: R16.2 R30.2 U1.5
R12_1: Q3.3 R24.1
RX0: H2.2 U1.40
SBU1: USB1.B8 USB4.A8
SBU2: USB1.A8 USB4.B8
SCL: R20.2 U1.39 U3.5 U5.6
SDA: R19.2 U1.42 U3.4 U5.7
SW: C18.1 D1.1 L1.2 U2.6
SW1: R26.1 SW2.2 U1.36
SW2: R25.1 SW1.2 U1.34
SW4: Q1.1 R23.2 U1.16
SW5: Q2.1 R21.2 U1.24
TX0: H2.3 U1.41
U3_4: R29.1 U2.4

Pads without a net: L2 2; LCD1 1 2 9; LCD1#2 1 2 9; LDO1 4; U1 6 7 8 10 12 25 26 27 28 29 30 31 32 33 35 44 45 47 48; U3 3; U5 2; USB1 A2 A3 A6 A7 A10 A11 B2 B3 B10 B11; USB4 A2 A3 A10 A11 B2 B3 B10 B11

## Via types
v1: diameter 0.45, hole 0.305, Top Layer to Bottom Layer, 132 vias
v2: diameter 0.61, hole 0.305, Top Layer to Bottom Layer, 40 vias

## Routing (per net, layer and track width the routed paths; a pad name or vN(x,y) marks a point on that pad's centre or on a via; arc(x,y) is an arc through that point)
3V3: length 101.6
  Top Layer w0.254: 29.47,20.06 29.45,20.04 v1(29.36,20.04) ; 25.88,8.82 25.88,8.2 26.13,7.95 ; 25.88,8.82 25.88,10.32 ; 25.88,8.82 U1.46 ; 26.13,7.95 25.78,7.6 25.78,7.13 25.75,7.1 ; 26.13,7.95 26.77,7.95 ; U1.37 25.55,13.32 25.88,12.98 25.88,10.32 ; 38.24,15.06 38.25,15.05 38.25,14.45 38.32,14.38 U5.4 ; 33.86,20.04 R22.1 ; U1.43 25.88,10.32 ; 26.77,7.95 27.08,7.95 27.27,7.75 U1.4 ; 26.77,7.95 U1.3 26.77,3.4 C15.2 ; U5.13 U5.12
  Top Layer w0.381: 37.44,14.55 38.15,14.55 38.25,14.45 ; 37.44,14.55 36.58,14.55 36.35,14.33 C12.2 36.35,12.99 36.57,12.78 37.35,12.78 37.52,12.61 37.52,10.69 ; 37.44,14.55 37.44,15.09 v1(37.46,15.11) ; 29.45,20.04 33.86,20.04 33.86,19.15 34.57,18.44 v1(37.46,18.44) 38.64,18.44 39.17,17.91 U5.13 ; 34.34,4.93 34.28,4.99 U3.6 34.28,9.42 ; R19.1 40.44,10.69 R20.1 37.52,10.69 ; H2.1 12.58,19.14 13.13,18.59 19.28,18.59 R26.2 20.12,17.09 20.47,16.74 23.52,16.74 25.06,15.2 U1.37 ; 37.52,10.69 37.52,9.42 ; 37.52,9.42 37.52,8.25 37.71,8.06 R30.1 ; 37.52,9.42 34.28,9.42 ; 34.28,9.42 34.28,10.12 33.58,10.82 U1.19
  Top Layer w0.635: 30.72,3.4 24.37,3.4 ; C13.2 35.6,3.78 34.34,3.78 ; 30.59,3.4 31.77,3.4 31.98,3.18 31.98,2.07 32.14,1.91 34.07,1.91 34.34,2.18 34.34,3.78 ; 34.34,3.78 34.34,4.93
  Bottom Layer w0.381: v1(37.46,18.44) v1(37.46,15.11) ; LCD1.10 31.14,14.19 31.34,14.4 31.34,15.34 31.09,15.59 LCD1.12 28.48,15.59 28.12,15.95 28.12,19.33 28.82,20.04 v1(29.36,20.04)
3V5: length 15.3
  Top Layer w0.508: LDO1.3 20.79,1.51 20.2,2.1 L1.1 20.2,3.2 20.41,3.41 LDO1.1 22.42,3.61 C4.2 22.47,9.47 R28.1 22.47,13.07 C17.1
GND: length 31.8
  Top Layer w0.254: U3.2 U3.1 ; U5.8 U5.9
  Top Layer w0.305: U3.2 35.78,12.55 34.95,13.37 C12.1 ; U3.7 34.78,8.62 v1(34.92,8.76)
  Top Layer w0.508: 35.65,2.32 35.65,1.13 35.23,0.71 31.04,0.71 30.72,1.03 C16.1 C14.1 28.75,1.45 v1(27.99,0.69)
  Bottom Layer w0.381: 27.81,12.07 27.81,12.57 28.03,12.79 LCD1.8 31.1,12.79 31.95,13.64 31.95,15.67 31.33,16.29 LCD1.13 ; 27.81,12.07 27.83,12.09 LCD1.7 ; 27.81,12.07 v1(27.81,10.67) v1(27.27,10.67) 27.33,10.61 v1(27.33,9.47) 27.84,9.47 v1(27.86,9.5) 27.86,10.03 v1(27.84,10.06)
  vias: v1(5.78,4.07) v1(12.71,7.35) v1(15.29,15.24) v1(18.59,9.52) v1(19.69,21.74) v1(21.03,9.58) v1(21.87,21.23) v1(22.22,2.46) v1(22.51,14.98) v1(23.43,22.03) v1(23.83,20.08) v1(23.93,9.71) v1(25.48,20.6) v1(26.79,1.99) v1(27.3,10.01) v1(30.45,17.58) v1(31.34,21.38) v1(36.28,10.15) v1(36.45,15.47) v1(37.91,0.8) v1(38.32,20.75) v1(39.42,15.56) v1(43.72,15.48) v1(44.19,1.54) v1(44.46,6.74) v1(47.17,17.85) v2(5.37,3.04) v2(5.37,2.32) v2(5.37,1.58) v2(6.1,3.04) v2(6.1,2.32) v2(6.1,1.58) v2(6.82,3.04) v2(6.82,2.32) v2(6.82,1.58) v2(9.53,17.12) v2(9.53,16.41) v2(9.53,15.67) v2(10.11,4.57) v2(10.25,17.12) v2(10.25,16.41) v2(10.25,15.67) v2(10.97,17.12) v2(10.97,16.41) v2(10.97,15.67) v2(11.7,17.12) v2(11.7,16.41) v2(11.7,15.67) v2(12.42,17.12) v2(12.42,16.41) v2(12.42,15.67) v2(17.87,11.38) v2(19.22,12.19) v2(23.83,7.24) v2(25.1,2.41) v2(36.98,6.22) v2(39.62,6.2) v2(46.82,4.31) v2(46.82,3.59) v2(46.82,2.86) v2(47.55,4.31) v2(47.55,3.59) v2(47.55,2.86) v2(48.27,4.31) v2(48.27,3.59) v2(48.27,2.86)
VBUS_I: length 21.8
  Top Layer w0.254: U3.8 U3.9 35.78,8.66 35.74,8.66
  Top Layer w0.305: C11.1 39.6,4.95 39.34,5.21 35.76,5.21 35.28,5.69 U3.8
  Top Layer w0.762: v1(45.08,14.2) 45.1,14.21 45.1,15.41
  Bottom Layer w0.508: v1(35.76,8.71) 36.91,8.71 37.41,9.22 41.07,9.22 41.73,9.88 41.73,12.72 R15.2
  vias: v1(41.4,13.92) v1(43.27,14.35) v1(43.27,13.72) v1(43.27,13.09) v1(43.27,12.46) v1(43.27,11.83) v1(43.27,11.21) v1(43.27,10.58) v1(43.27,9.95) v1(43.27,9.32) v1(43.86,14.35) v1(43.86,13.72) v1(43.86,13.09) v1(43.86,12.46) v1(43.86,11.83) v1(43.86,11.21) v1(43.86,10.58) v1(43.86,9.95) v1(43.86,9.32) v1(44.48,14.33) v1(44.48,13.7) v1(44.48,13.07) v1(44.48,12.44) v1(44.48,11.82) v1(44.48,11.19) v1(44.48,10.56) v1(44.48,9.93) v1(44.48,9.3)
VBUS_O: length 46
  Top Layer w0.305: U3.10 36.28,7.66 v1(36.35,7.72)
  Top Layer w0.635: 14.86,12.19 U2.5 17.47,12.19 17.98,12.71 17.98,14.83 18.04,14.89 ; 14.86,12.19 12.75,12.19 12.12,12.83 v1(12.12,13.16) ; 14.86,12.19 C1.1
  Bottom Layer w0.508: 40.5,7.98 40.5,2.57 40.2,2.27 v1(39.62,2.27)
  Bottom Layer w0.762: R15.1 40.34,7.83 32.8,7.83 31.34,6.38 15.95,6.38 12.42,9.91
  vias: v1(10.4,13.75) v1(10.43,13.2) v1(10.98,13.73) v1(11.01,13.18) v1(11.56,13.7) v1(11.59,13.16) v1(12.09,13.7) v1(12.11,10.76) v1(12.11,10.21) v1(12.11,9.67) v1(12.11,9.12) v1(12.67,13.7) v1(12.7,13.16) v1(12.73,10.76) v1(12.73,10.21) v1(12.73,9.67) v1(12.73,9.12)
BST: length 6
  Top Layer w0.508: U2.1 19.43,11.03 19.43,7.62 ; D2.1 19.43,7.62 ; 19.43,7.62 19.38,7.62 19.37,7.61 C18.2
CC1: length 67.9
  Top Layer w0.254: USB4.A5 8.64,12.18 8.96,12.5 10.62,12.5 10.88,12.24 v1(10.88,11.83) ; v1(46.86,12.19) 47.02,12.04 48.87,12.04 USB1.B5
  Inner1 w0.305: v1(46.86,12.19) 46.86,14.66 44.81,16.71 v1(42.77,16.71) 34.9,16.71 32.97,18.65 15.13,18.65 13.87,17.39 13.87,12.56 13.14,11.83 v1(10.88,11.83)
  Inner2 w0.254: v1(41.53,1.6) 41.5,1.58
  Inner2 w0.305: v1(46.86,12.19) 46.51,12.55 45.67,12.55 45.3,12.18 45.3,4.02 44.66,3.38 41.78,3.38 41.53,3.12 v1(41.53,1.6)
CC1_2: length 18.9
  Top Layer w0.28: Q1.2 42.03,16.06
  Top Layer w0.305: SW3.2 45.55,2.43 42.32,5.66 42.32,15.04 42.03,15.33 42.03,16.06 U5.10 40.59,16.07 40.59,16.64 40.49,16.74 U5.11
CC2: length 65.1
  Top Layer w0.305: SW5.2 13.28,1.84 13.28,5.16 12.98,5.46 v1(12.62,5.46)
  Inner1 w0.305: v1(12.62,5.46) 12.04,5.46 10.26,7.24 10.26,11.18 v1(10.34,11.25) 10.38,11.3 13.33,11.3 14.35,12.31 14.35,17.05 15.46,18.16 32.26,18.16 32.84,17.58 v1(32.94,17.58) 32.94,17.55 34.26,16.23 42.4,16.23 42.6,16.03 44.5,16.03 46.21,14.31 46.21,12.22 v1(46.01,12.02)
  Bottom Layer w0.254: v1(10.34,11.25) 10.34,10.89 9.86,10.41 8.75,10.41 8.48,10.68 USB4.B5 ; USB1.A5 46.18,10.49 45.91,10.76 45.91,11.92 v1(46.01,12.02)
CC2_2: length 46.2
  Top Layer w0.28: U5.14 38.67,17.18 38.05,17.8 Q2.2
  Top Layer w0.305: U5.14 38.27,16.74 38.24,16.71 38.24,16.06 ; SW5.1 9.04,5.28 10.01,6.25 14.22,6.25 14.55,6.58 14.55,8.71 v1(14.96,9.12) ; Q2.2 33.71,18.01 33.4,18.31 32.03,18.31 31.67,17.96 v1(31.67,16.97)
  Inner2 w0.305: v1(14.96,9.12) 15.15,8.93 29.51,8.93 29.99,9.41 29.99,12.97 31.67,14.66 v1(31.67,16.97)
CNTL_INT: length 19.1
  Top Layer w0.254: U1.38 24.52,12.82 24.26,13.08 24.26,14.55 v1(24.43,14.73)
  Top Layer w0.28: U5.5 39.17,13.9 38.66,13.39 v1(37.72,13.39)
  Inner1 w0.305: v1(37.72,13.39) 24.97,13.39 24.43,13.92 v1(24.43,14.73)
DN: length 88.4
  Top Layer w0.254: USB4.A7 9.1,11.18 v1(9.22,11.3) ; U1.11 30.77,6.23 31.01,5.99 32.66,5.99 v1(33.15,6.48) ; v1(47.13,11.09) 47.23,10.99 USB1.B7
  Top Layer w0.305: U1.15 31.99,8.81 31.27,8.81 30.77,8.32 U1.11
  Inner1 w0.305: v1(47.13,11.09) 47.13,6.51 45.46,4.85 11.77,4.85 9.22,7.39 v1(9.22,11.3)
  Inner2 w0.305: v1(9.22,11.3) 9.22,8.94 10.28,7.88 32.79,7.88 33.15,7.53 v1(33.15,6.48)
  Bottom Layer w0.254: USB4.B7 9.06,11.68 9.22,11.52 v1(9.22,11.3)
DP: length 88.5
  Top Layer w0.254: v1(9.78,11.53) 9.5,11.81 8.81,11.81 8.66,11.66 7.25,11.66 ; v1(47.73,11.51) 47.74,11.49 USB1.B6
  Top Layer w0.305: v1(33.5,8.97) 32.85,8.32 U1.14 U1.13
  Inner1 w0.305: v1(9.78,11.53) 9.45,11.86 8.78,11.86 8.52,11.61 8.52,7.15 11.38,4.3 45.79,4.3 47.73,6.24 v1(47.73,11.51)
  Inner2 w0.305: v1(33.5,8.97) 32.93,8.4 10.58,8.4 9.78,9.2 v1(9.78,11.53)
  Bottom Layer w0.203: USB4.B6 8.56,11.18 8.95,10.8 9.57,10.8 9.78,11.01 v1(9.78,11.53)
EN: length 6.4
  Top Layer w0.254: U1.9 29.77,5.41 30.15,5.03 32.46,5.03 33.1,4.39 R17.2
FB: length 7.1
  Top Layer w0.508: R28.2 21,11.32 C17.2 20.96,13.17 R27.2 19.5,14.98 19.22,14.7 U2.3
IO0: length 15
  Top Layer w0.203: v1(36.5,19.96) 36.45,20.01 SW4.1
  Top Layer w0.305: U1.23 32.63,12.82 32.94,13.13 32.94,14.61 v1(33.22,14.88) ; R22.2 34.74,21.57 34.87,21.43 34.87,20.15 35.06,19.96 36.33,19.96 SW4.1
  Bottom Layer w0.305: v1(33.22,14.88) 33.22,16.36 33.48,16.61 35.99,16.61 36.5,17.12 v1(36.5,19.96)
LCD1_11: length 6.2
  Bottom Layer w0.305: LCD1.11 28.26,14.89 27.33,15.83 27.33,16.88 26.93,17.27 v1(25.22,17.27)
LCD_BL: length 9.6
  Top Layer w0.305: Q3.1 31.71,15.69 32.13,16.1 v1(32.56,16.1) ; v1(33.88,14.12) 33.6,13.84 33.6,11.86 33.06,11.32 U1.20
  Bottom Layer w0.254: v1(33.88,14.12) 33.83,14.18 32.69,14.18 32.56,14.3 v1(32.56,16.1)
LCD_CLK: length 1.5
  Top Layer w0.254: v1(30.66,9.98) 31.08,9.98 31.42,10.32 U1.18
LCD_D/C: length 2.2
  Top Layer w0.254: U1.21 31.3,11.82 31.17,11.68 31.17,10.95 30.91,10.69 v1(30.68,10.69)
LCD_MOSI: length 1.5
  Top Layer w0.254: U1.17 31.51,9.82 30.99,9.3 v1(30.66,9.3)
LCD_RST: length 2.1
  Top Layer w0.254: v1(30.66,11.4) 30.66,12.11 30.86,12.32 U1.22
LNA_IN: length 19.7
  Top Layer w0.305: U1.2 26.27,5.52 arc(26.08,5.05) 25.6,4.85 23.9,4.85 arc(23.54,4.7) 23.39,4.34 23.39,1.35 arc(23.21,0.9) 22.76,0.71 15.27,0.71 arc(15,0.82) v1(14.88,1.09)
  Bottom Layer w0.305: v1(14.88,1.09) 14.88,1.6 arc(14.74,1.95) 14.39,2.1 L2.1
P36: length 15.8
  Top Layer w0.28: v1(27.84,5.49) 27.77,5.55 U1.5
  Top Layer w0.381: v1(38.23,5.99) 38.23,7.16 R30.2
  Bottom Layer w0.381: v1(27.84,5.49) 33.91,5.49 35.65,3.75 v1(37.6,3.75) 38.23,4.37 v1(38.23,5.99)
R12_1: length 2
  Top Layer w0.305: Q3.3 27.93,17.25 R24.1
RX0: length 22
  Top Layer w0.254: v1(18.57,16.87) 19.2,16.23 23.27,16.23 23.8,15.69 23.8,12.08 24.07,11.82 U1.40
  Bottom Layer w0.254: H2.2 9.75,20.67 9.75,19.89 10.67,18.97 16.46,18.97 v1(18.57,16.87)
SBU1: length 50.9
  Top Layer w0.254: USB1.B8 46.99,10.49 v1(46.46,11.02) ; USB4.A8 10.75,10.68 v1(10.85,10.77)
  Inner1 w0.305: v1(46.46,11.02) 46.46,6.68 45.21,5.44 30.58,5.44 30,6.02 12.39,6.02 10.93,7.48 10.93,10.68 v1(10.85,10.77)
SBU2: length 55.1
  Inner1 w0.203: 46.56,11.64 v1(46.57,11.63)
  Inner1 w0.305: v1(46.57,11.63) 47.06,11.63 47.42,11.99 47.42,15.75 45.78,17.39 34.99,17.39 33.17,19.21 14.86,19.21 13.41,17.76 13.41,12.82 12.99,12.4 10.7,12.4 10.27,11.98 v1(10.27,11.89)
  Bottom Layer w0.254: v1(10.27,11.89) 9.99,12.18 USB4.B8 ; 46.56,11.64 46.57,11.63 47.01,11.63 47.4,12.01 49.01,12.01 49.03,11.99
SCL: length 19.1
  Top Layer w0.203: 38.68,12.21 v1(38.67,12.2)
  Top Layer w0.254: U1.39 24.34,12.32 v1(24.31,12.34) ; U3.5 34.28,12.44 v1(34.29,12.45)
  Top Layer w0.305: v1(38.67,12.2) 39.02,12.2 39.67,12.85 U5.6
  Inner1 w0.254: v1(24.31,12.34) 24.41,12.45 v1(34.29,12.45) 38.43,12.45 38.68,12.19
SDA: length 23.3
  Top Layer w0.203: v1(40.39,12.25) R19.2
  Top Layer w0.254: 34.77,10.34 34.78,10.35 U3.4 ; U1.42 v1(23.88,10.82)
  Top Layer w0.305: U5.7 40.17,13.27 40.39,13.06 v1(40.39,12.25)
  Inner1 w0.254: v1(34.82,10.42) 34.83,10.43 34.83,11.69 ; 34.83,11.69 33.42,11.69 33.2,11.91 26.14,11.91 25.04,10.82 v1(23.88,10.82) ; 34.83,11.69 39.89,11.69 40.36,12.17 40.46,12.06
SW: length 8.7
  Top Layer w0.508: U2.6 16.47,11.19 16.47,7.9
  Top Layer w0.635: L1.2 16.47,2.9 16.47,7.9
SW1: length 10.9
  Top Layer w0.305: 19.12,20.03 19.12,20.01 19.12,20 21.1,20 21.63,19.48 R26.1 23.25,17.75 25.77,15.23 U1.36
SW2: length 10.6
  Top Layer w0.305: U1.34 26.77,15.14 25.96,15.95 25.96,18.06 26.2,18.3 26.98,18.3 27.23,18.55 SW1.2 27.23,20.76 27.38,20.9 28.96,20.9 29.38,21.33 R25.1
SW4: length 21.2
  Top Layer w0.254: U1.16 32.81,9.32 v1(32.94,9.45)
  Top Layer w0.305: 42.03,17.99 42.03,19.5 R23.2 ; 42.03,17.99 Q1.1 ; 42.03,17.99 41.29,17.99 v1(41.25,18.03)
  Inner2 w0.305: v1(32.94,9.45) 33.15,9.65 35.26,9.65 35.56,9.96 35.56,17.34 36.13,17.91 41.12,17.91 v1(41.25,18.03)
SW5: length 7.6
  Top Layer w0.254: R21.2 34.85,15.51 32.66,15.51 31.99,14.84 U1.24
  Top Layer w0.28: Q2.1 34.62,17.35 34.85,17.12 34.85,15.51
  vias: v1(34.87,15.44)
TX0: length 24.3
  Top Layer w0.254: v1(18.06,16.41) 18.69,15.77 23.11,15.77 23.39,15.49 23.39,11.86 23.94,11.32 U1.41
  Bottom Layer w0.254: H2.3 7.5,19.96 8.94,18.52 15.95,18.52 v1(18.06,16.41)
U3_4: length 1.8
  Top Layer w0.635: 16.54,14.92 16.52,14.9 U2.4

## Copper pours and planes (outline as drawn; the poured copper is in the pictures)
GND on Top Layer: 23.94,-0.43 -0.23,-0.43 -0.23,23.01 53.18,23.01 53.18,-0.46 33.52,-0.57 33.44,13.61 24,13.59
GND on Top Layer: 21.33,5.23 35.48,5.23 35.48,-0.56 21.33,-0.56
GND on Top Layer: 21.33,6.38 32.54,6.38 32.54,1.45 21.33,1.45
GND on Bottom Layer: 21.35,6.38 32.54,6.38 32.54,1.42 21.35,1.42
GND on Bottom Layer: -0.44,23.09 53.14,23.09 53.14,-0.37 -0.33,-0.58
GND on Inner1: 21.37,6.38 32.54,6.38 32.54,1.45 21.37,1.45
GND on Inner1: 0.11,23.01 53.24,23.01 53.24,-0.33 0.11,-0.33
GND on Inner2: -0.37,23.12 52.9,23.06 52.9,-0.36 -0.51,-0.36
VBUS_I on Top Layer: 42.94,14.68 49.67,14.68 49.67,8.99 42.94,8.99
VBUS_I on Bottom Layer: 38.65,14.69 49.67,14.69 49.67,8.98 38.65,8.98
VBUS_O on Top Layer: 6.37,14.01 13.07,14.01 13.07,8.68 6.37,8.68
VBUS_O on Bottom Layer: 13.79,11.33 13.79,8.41 16.3,5.47 39.04,5.5 39.04,8.64 18.43,8.78 16.08,11.33
VBUS_O on Bottom Layer: 6.38,14.01 13.05,14.01 13.05,8.72 6.38,8.72

Small or netless copper shapes (teardrops, artwork), in the pictures only: 188 on Top Layer, 46 on Bottom Layer, 28 on Inner1, 11 on Inner2

## Text on the board
Bottom Silkscreen Layer: TX | RX | 3V3

# Board 电流表0603板优化版加大面板
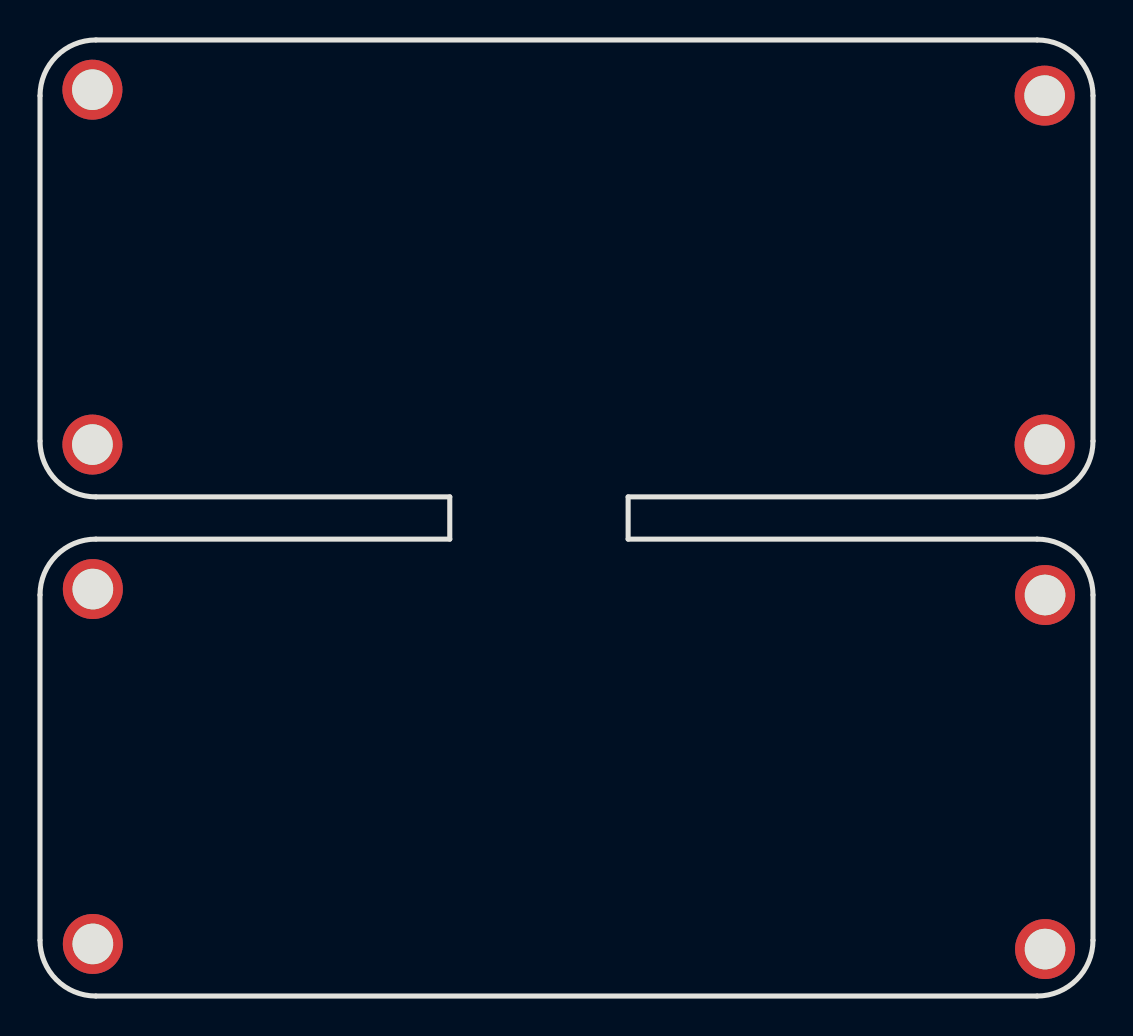
[diagram p3: board, top side]
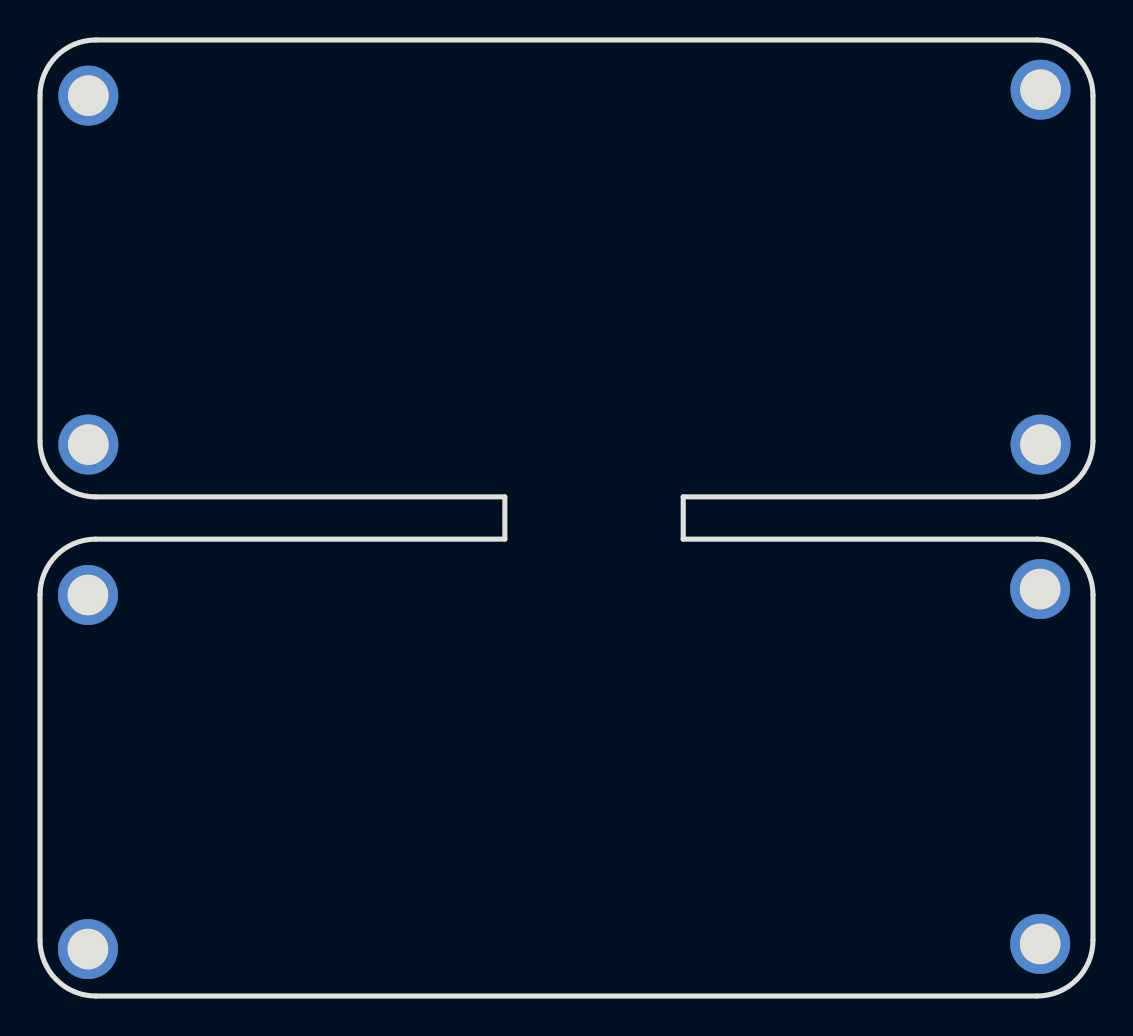
[diagram p4: board, bottom side, seen from below]

Outline 52.66 x 47.85 mm; copper layers: Top Layer, Bottom Layer. Coordinates in mm from the lower left corner of the outline.
Outline path: 0,20.07 0,2.79 arc(0.82,0.82) 2.79,0 49.86,0 arc(51.84,0.82) 52.66,2.79 52.66,20.07 arc(51.84,22.05) 49.86,22.87 29.41,22.87 29.41,24.98 49.86,24.98 arc(51.84,25.8) 52.66,27.77 52.66,45.05 arc(51.84,47.03) 49.86,47.85 2.8,47.85 arc(0.82,47.03) 0,45.05 0,27.77 arc(0.82,25.8) 2.8,24.98 20.49,24.98 20.49,22.87 2.79,22.87 arc(0.82,22.05) 0,20.07
Stack: Top Layer 0.035mm / Dielectric1 1.51mm FR4 er 4.5 / Bottom Layer 0.035mm

## Design rules (mm)
template: JLCPCB Capability(Two Layers Board)
spacing copperThickness1oz (default): track to track 0.102, other pairs 0.152 to 0.3
spacing copperThickness2oz: track to track 0.203, other pairs 0.152 to 0.3
track width copperThickness1oz (default): min 0.127, default 0.254, max 2.54
track width copperThickness2oz: min 0.203, default 0.254, max 2.54
differential pair differentialPair (default): width min 0.127, default 0.254, max 2.54; gap min 0.152, default 0.152
via viaSize (default): diameter min 0.5, default 0.61, max 10; hole min 0.3, default 0.305, max 6.3

## Placement (name value [footprint] x y rotation side)
NOREF  -  [Pad_e89]  50.24 45.06 0 top
NOREF#2  -  [Pad_e91]  2.62 27.6 0 top
NOREF#3  -  [Pad_e3]  2.64 20.37 0 top
NOREF#4  -  [Pad_e88]  50.24 27.6 0 top
NOREF#5  -  [Pad_e1]  50.26 2.35 0 top
NOREF#6  -  [Pad_e2]  2.64 2.61 0 top
NOREF#7  -  [Pad_e90]  2.62 45.36 0 top
NOREF#8  -  [Pad_e4]  50.26 20.07 0 top

## Footprints (pads in the part's own frame, mm; a bottom-side part is the same pattern mirrored in y, then rotated)
Pad_e1
  round 3 hole 2.032: 2(0,0)
Pad_e2
  round 3 hole 2.032: 2(0,0)
Pad_e3
  round 3 hole 2.032: 2(0,0)
Pad_e4
  round 3 hole 2.032: 2(0,0)
Pad_e88
  round 3 hole 2.032: 2(0,0)
Pad_e89
  round 3 hole 2.032: 2(0,0)
Pad_e90
  round 3 hole 2.032: 2(0,0)
Pad_e91
  round 3 hole 2.032: 2(0,0)

## Nets
GND: NOREF.2 NOREF#2.2 NOREF#3.2 NOREF#4.2 NOREF#5.2 NOREF#6.2 NOREF#7.2 NOREF#8.2

## Copper pours and planes (outline as drawn; the poured copper is in the pictures)
GND on Top Layer: -2.33,49.04 53.63,49.04 53.63,-1.23 -2.33,-1.23
GND on Bottom Layer: -2.33,49.25 53.04,49.25 53.04,-0.61 -2.33,-0.61

## Text on the board
Top Solder Mask Layer: METER | USB
